# EAGLE design Main (EAGLE 7.2.0)
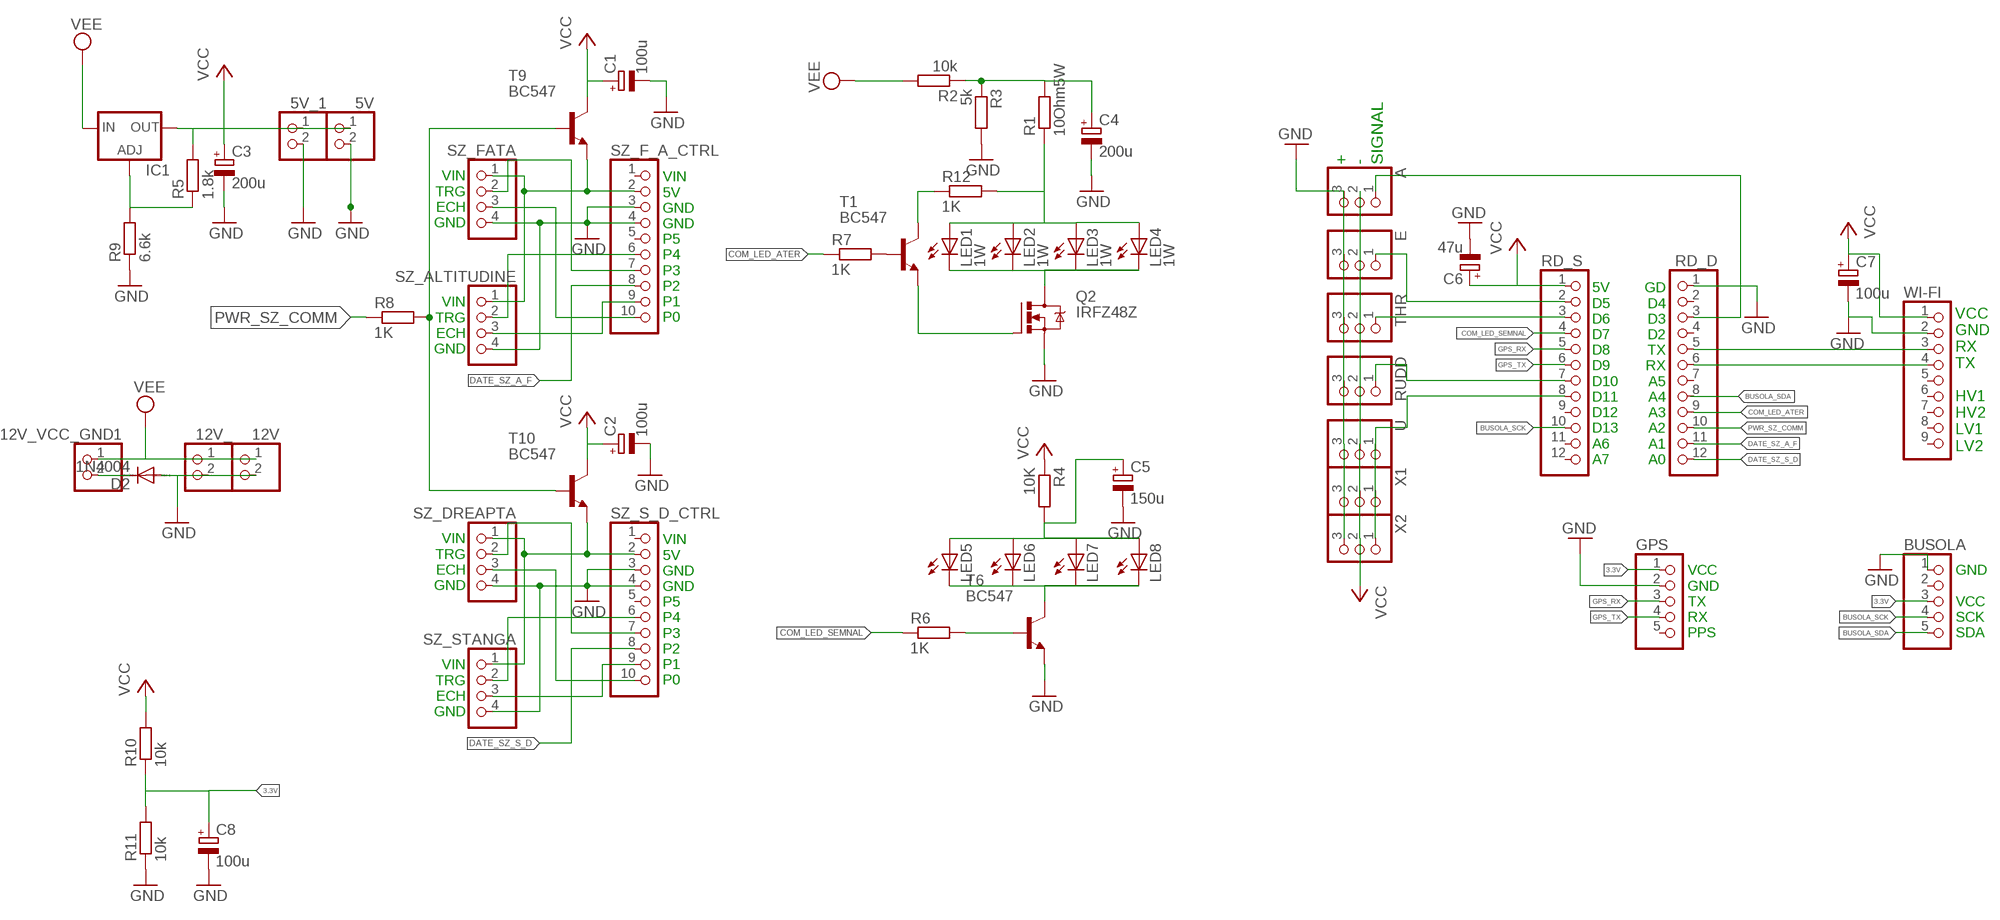
[diagram p0: schematic, sheet 1]

## Parts
5V  PINHD-1X2  [1X02]
5V_1  PINHD-1X2  [1X02]
12V  PINHD-1X2  [1X02]
12V_  PINHD-1X2  [1X02]
12V_VCC_GND1  PINHD-1X2  [1X02]
A  PINHD-1X3/90  [1X03/90]
BUSOLA  PINHD-1X5  [1X05]
C1  100u  CPOL-EUE2-5  [E2-5]
C2  100u  CPOL-EUE2-5  [E2-5]
C3  200u  CPOL-EUE2-5  [E2-5]
C4  200u  CPOL-EUE2-5  [E2-5]
C5  150u  CPOL-EUE2-5  [E2-5]
C6  47u  CPOL-EUE2-5  [E2-5]
C7  100u  CPOL-EUE2-5  [E2-5]
C8  100u  CPOL-EUE2-5  [E2-5]
D2  1N4004  [DO41-10]
E  PINHD-1X3/90  [1X03/90]
GPS  PINHD-1X5  [1X05]
IC1  LM317TL  [317TL]
LED1  1W  LEDSIDELED  [OSRAM-SIDELED]
LED2  1W  LEDSIDELED  [OSRAM-SIDELED]
LED3  1W  LEDSIDELED  [OSRAM-SIDELED]
LED4  1W  LEDSIDELED  [OSRAM-SIDELED]
LED5  LED5MM  [LED5MM]
LED6  LED5MM  [LED5MM]
LED7  LED5MM  [LED5MM]
LED8  LED5MM  [LED5MM]
Q2  IRFZ48Z  [TO220BH]
R1  10Ohm5W  R-EU_0309/12  [0309/12]
R2  10k  R-EU_0309/12  [0309/12]
R3  5k  R-EU_0309/12  [0309/12]
R4  10K  R-EU_0309/12  [0309/12]
R5  1.8k  R-EU_0309/12  [0309/12]
R6  1K  R-EU_0309/12  [0309/12]
R7  1K  R-EU_0309/12  [0309/12]
R8  1K  R-EU_0309/12  [0309/12]
R9  6.6k  R-EU_0309/12  [0309/12]
R10  10k  R-EU_0309/12  [0309/12]
R11  10k  R-EU_0309/12  [0309/12]
R12  1K  R-EU_0309/12  [0309/12]
RD_D  PINHD-1X12  [1X12]
RD_S  PINHD-1X12  [1X12]
RUDD  PINHD-1X3/90  [1X03/90]
SZ_ALTITUDINE  PINHD-1X4  [1X04]
SZ_DREAPTA  PINHD-1X4  [1X04]
SZ_F_A_CTRL  PINHD-1X10  [1X10]
SZ_FATA  PINHD-1X4  [1X04]
SZ_S_D_CTRL  PINHD-1X10  [1X10]
SZ_STANGA  PINHD-1X4  [1X04]
T1  BC547  [TO92]
T6  BC547  [TO92]
T9  BC547  [TO92]
T10  BC547  [TO92]
THR  PINHD-1X3/90  [1X03/90]
U  PINHD-1X3/90  [1X03/90]
WI-FI  PINHD-1X9  [1X09]
X1  PINHD-1X3/90  [1X03/90]
X2  PINHD-1X3/90  [1X03/90]

## Nets
3.3V: BUSOLA.3 C8.+ GPS.1 R10.1 R11.2
BUSOLA_SCK: BUSOLA.4 RD_S.10
BUSOLA_SDA: BUSOLA.5 RD_D.8
COM_ALIM_SZ_S_D: R8.2 T9.2(B) T10.2(B)
COM_LED_ATER: R7.1 RD_D.9
COM_LED_SEMNAL: R6.1 RD_S.4
DATE_SZ_A_F: RD_D.11 SZ_F_A_CTRL.8
DATE_SZ_S_D: RD_D.12 SZ_S_D_CTRL.8
GND: 5V.2 5V_1.2 12V.2 12V_.2 A.3 BUSOLA.1 C1.- C2.- C3.- C4.- C5.- C6.- C7.- C8.- D2.A E.3 GPS.2 Q2.S R3.2 R9.1 R11.1 RD_D.1 RUDD.3 SZ_ALTITUDINE.4 SZ_DREAPTA.4 SZ_F_A_CTRL.3 SZ_F_A_CTRL.4 SZ_FATA.4 SZ_S_D_CTRL.3 SZ_S_D_CTRL.4 SZ_STANGA.4 T6.1(E) THR.3 U.3 WI-FI.2 X1.3 X2.3
GPS_RX: GPS.3 RD_S.5
GPS_TX: GPS.4 RD_S.6
N$1: SZ_F_A_CTRL.7 SZ_FATA.2
N$2: 12V_VCC_GND1.2 D2.C
N$3: IC1.1(ADJ) R5.1 R9.2
N$5: SZ_F_A_CTRL.10 SZ_FATA.3
N$6: SZ_ALTITUDINE.2 SZ_F_A_CTRL.6
N$7: SZ_ALTITUDINE.3 SZ_F_A_CTRL.9
N$8: SZ_DREAPTA.2 SZ_S_D_CTRL.7
N$9: SZ_DREAPTA.3 SZ_S_D_CTRL.10
N$10: SZ_S_D_CTRL.6 SZ_STANGA.2
N$11: SZ_S_D_CTRL.9 SZ_STANGA.3
N$12: SZ_ALTITUDINE.1 SZ_F_A_CTRL.2 SZ_FATA.1 T9.1(E)
N$13: SZ_DREAPTA.1 SZ_S_D_CTRL.2 SZ_STANGA.1 T10.1(E)
N$14: LED1.C LED2.C LED3.C LED4.C Q2.D
N$15: LED1.A LED2.A LED3.A LED4.A R1.1 R12.2
N$16: Q2.G T1.1(E)
N$17: C4.+ R1.2 R2.1 R3.1
N$19: LED5.K(C) LED6.K(C) LED7.K(C) LED8.K(C) T6.3(C)
N$20: C5.+ LED5.A LED6.A LED7.A LED8.A R4.2
N$21: A.1 RD_D.3
N$22: R6.2 T6.2(B)
N$23: R7.2 T1.2(B)
N$24: E.1 RD_S.2
N$25: RD_S.3 THR.1
N$26: RD_S.7 RUDD.1
N$27: R12.1 T1.3(C)
N$35: RD_S.8 U.1 X1.1 X2.1
N$37: RD_D.5 WI-FI.3
N$38: RD_D.6 WI-FI.4
PWR_SZ_COMM: R8.1 RD_D.10
VCC: 5V.1 5V_1.1 A.2 C1.+ C2.+ C3.+ C6.+ C7.+ E.2 IC1.2(OUT) R4.1 R5.2 R10.2 RD_S.1 RUDD.2 T9.3(C) T10.3(C) THR.2 U.2 WI-FI.1 X1.2 X2.2
VEE: 12V.1 12V_.1 12V_VCC_GND1.1 IC1.3(IN) R2.2
Unconnected: BUSOLA.2 GPS.5 RD_D.2 RD_D.4 RD_D.7 RD_S.9 RD_S.11 RD_S.12 SZ_F_A_CTRL.1 SZ_F_A_CTRL.5 SZ_S_D_CTRL.1 SZ_S_D_CTRL.5 WI-FI.5 WI-FI.6 WI-FI.7 WI-FI.8 WI-FI.9

## Notes on the sheet
- +
  -
  SIGNAL
- VIN
  TRG
  ECH
  GND
- VIN
  5V
  GND
  GND
  P5
  P4
  P3
  P2
  P1
  P0
- VIN
  TRG
  ECH
  GND
- 5V
  D5
  D6
  D7
  D8
  D9
  D10
  D11
  D12
  D13
  A6
  A7
- GD
  D4
  D3
  D2
  TX
  RX
  A5
  A4
  A3
  A2
  A1
  A0
- VCC
  GND
  RX
  TX
  
  HV1
  HV2
  LV1
  LV2
- VIN
  TRG
  ECH
  GND
- VCC
  GND
  TX
  RX
  PPS
- GND
  
  VCC
  SCK
  SDA
- VIN
  5V
  GND
  GND
  P5
  P4
  P3
  P2
  P1
  P0
- VIN
  TRG
  ECH
  GND

## Library data of the parts
5V 5V_1 12V 12V_ 12V_VCC_GND1 = pinhead:PINHD-1X2: PIN HEADER
A E RUDD THR U X1 X2 = pinhead:PINHD-1X3: PIN HEADER
BUSOLA GPS = pinhead:PINHD-1X5: PIN HEADER
C1-C8 = resistor:CPOL-EU: POLARIZED CAPACITOR, European symbol
D2 = diode:1N4004: DIODE general purpose rectifier, 1 A
IC1 = v-reg:LM317TL: VOLTAGE REGULATOR
LED1-LED8 = led:LED: LED OSRAM: - CHIPLED LG R971, LG N971, LY N971, LG Q971, LY Q971, LO R971, LY R971 LH N974, LH R974 LS Q976, LO Q976, LY Q976 LO Q996 - Hyper CHIPLED LW Q18S LB Q993, LB Q99A, LB R99A - SideLED LS A670, LO A670, LY A670, LG A670, LP A670 LB A673, LV A673, LT A673, LW A673 LH A674 LY A675 LS A676, LA A676, LO A676, LY A676, LW A676 LS A679, LY A679, LG A679 - Hyper Micro SIDELED® LS Y876, LA Y876, LO Y876, LY Y876 LT Y87S - SmartLED LW L88C, LW L88S LB L89C, LB L89S, LG L890 LS L89K, LO L89K, LY L89K LS L896, LA L896, LO L896, LY L896 - TOPLED LS T670, LO T670, LY T670, LG T670, LP T670 LSG T670, LSP T670, LSY T670, LOP T670, LYG T670 LG T671, LOG T671, LSG T671 LB T673, LV T673, LT T673, LW T673 LH T674 LS T676, LA T676, LO T676, LY T676, LB T676, LH T676, LSB T676, LW T676 LB T67C, LV T67C, LT T67C, LS T67K, LO T67K, LY T67K, LW E67C LS E67B, LA E67B, LO E67B, LY E67B, LB E67C, LV E67C, LT E67C LW T67C LS T679, LY T679, LG T679 LS T770, LO T770, LY T770, LG T770, LP T770 LB T773, LV T773, LT T773, LW T773 LH T774 LS E675, LA E675, LY E675, LS T675 LS T776, LA T776, LO T776, LY T776, LB T776 LHGB T686 LT T68C, LB T68C - Hyper Mini TOPLED® LB M676 - Mini TOPLED Santana® LG M470 LS M47K, LO M47K, LY M47K Source: http://www.osram.convergy.de LUXEON: - LUMILED® LXK2-PW12-R00, LXK2-PW12-S00, LXK2-PW14-U00, LXK2-PW14-V00 LXK2-PM12-R00, LXK2-PM12-S00, LXK2-PM14-U00 LXK2-PE12-Q00, LXK2-PE12-R00, LXK2-PE12-S00, LXK2-PE14-T00, LXK2-PE14-U00 LXK2-PB12-K00, LXK2-PB12-L00, LXK2-PB12-M00, LXK2-PB14-N00, LXK2-PB14-P00, LXK2-PB14-Q00 LXK2-PR12-L00, LXK2-PR12-M00, LXK2-PR14-Q00, LXK2-PR14-R00 LXK2-PD12-Q00, LXK2-PD12-R00, LXK2-PD12-S00 LXK2-PH12-R00, LXK2-PH12-S00 LXK2-PL12-P00, LXK2-PL12-Q00, LXK2-PL12-R00 Source: www.luxeon.com KINGBRIGHT: KA-3528ASYC Source: www.kingbright.com
Q2 = transistor-power:IRFZ48: N Channel HEXFET® Power MOSFET Logic Level Source: http://www.irf.com/product-info/datasheets/data/irfz48z.pdf
R1-R12 = rcl:R-EU_: RESISTOR, European symbol
RD_D RD_S = pinhead:PINHD-1X12: PIN HEADER
SZ_ALTITUDINE SZ_DREAPTA SZ_FATA SZ_STANGA = pinhead:PINHD-1X4: PIN HEADER
SZ_F_A_CTRL SZ_S_D_CTRL = pinhead:PINHD-1X10: PIN HEADER
T1 T6 T9 T10 = transistor:BC547: NPN TRANSISTOR
WI-FI = pinhead:PINHD-1X9: PIN HEADER

## Board
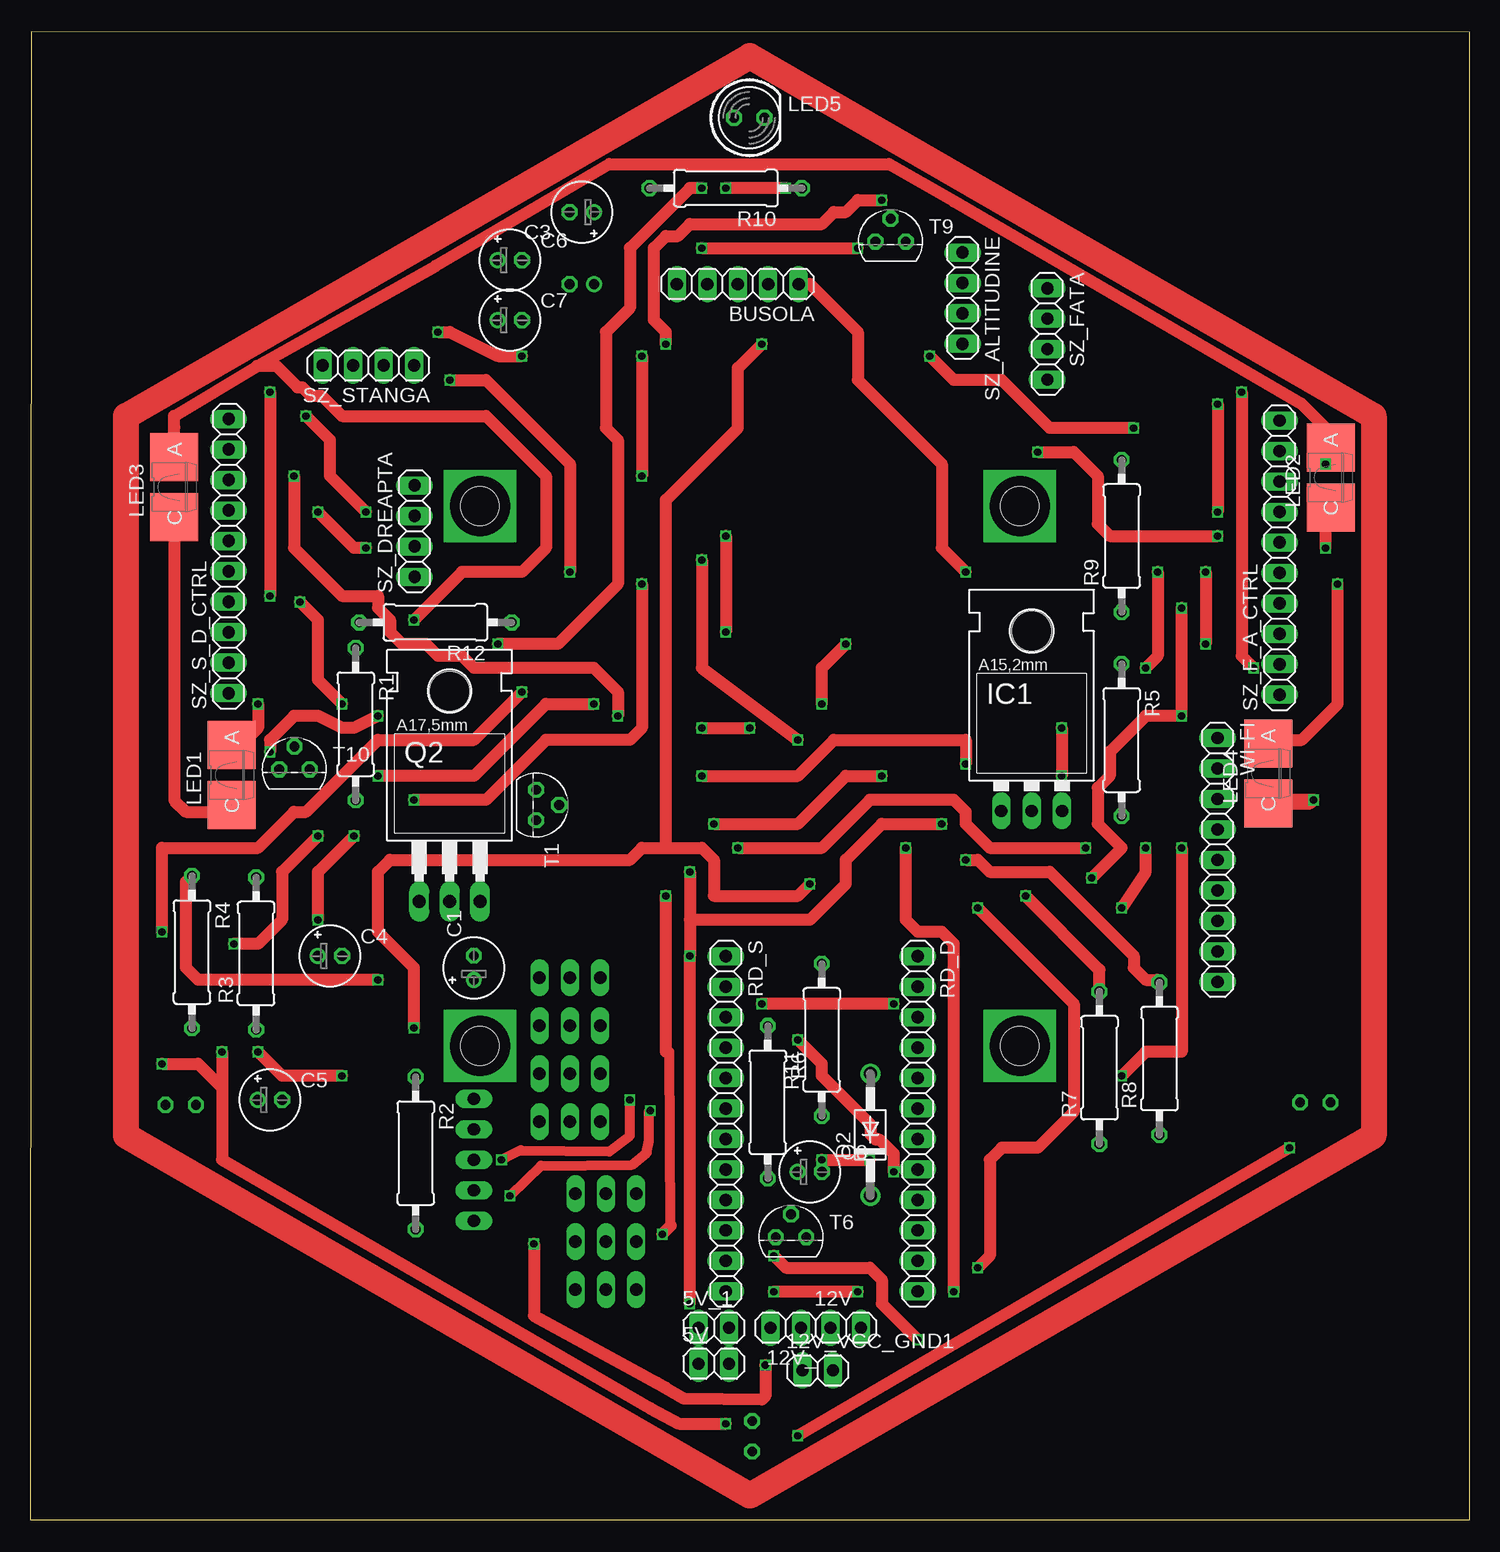
[diagram p1: board, top side]
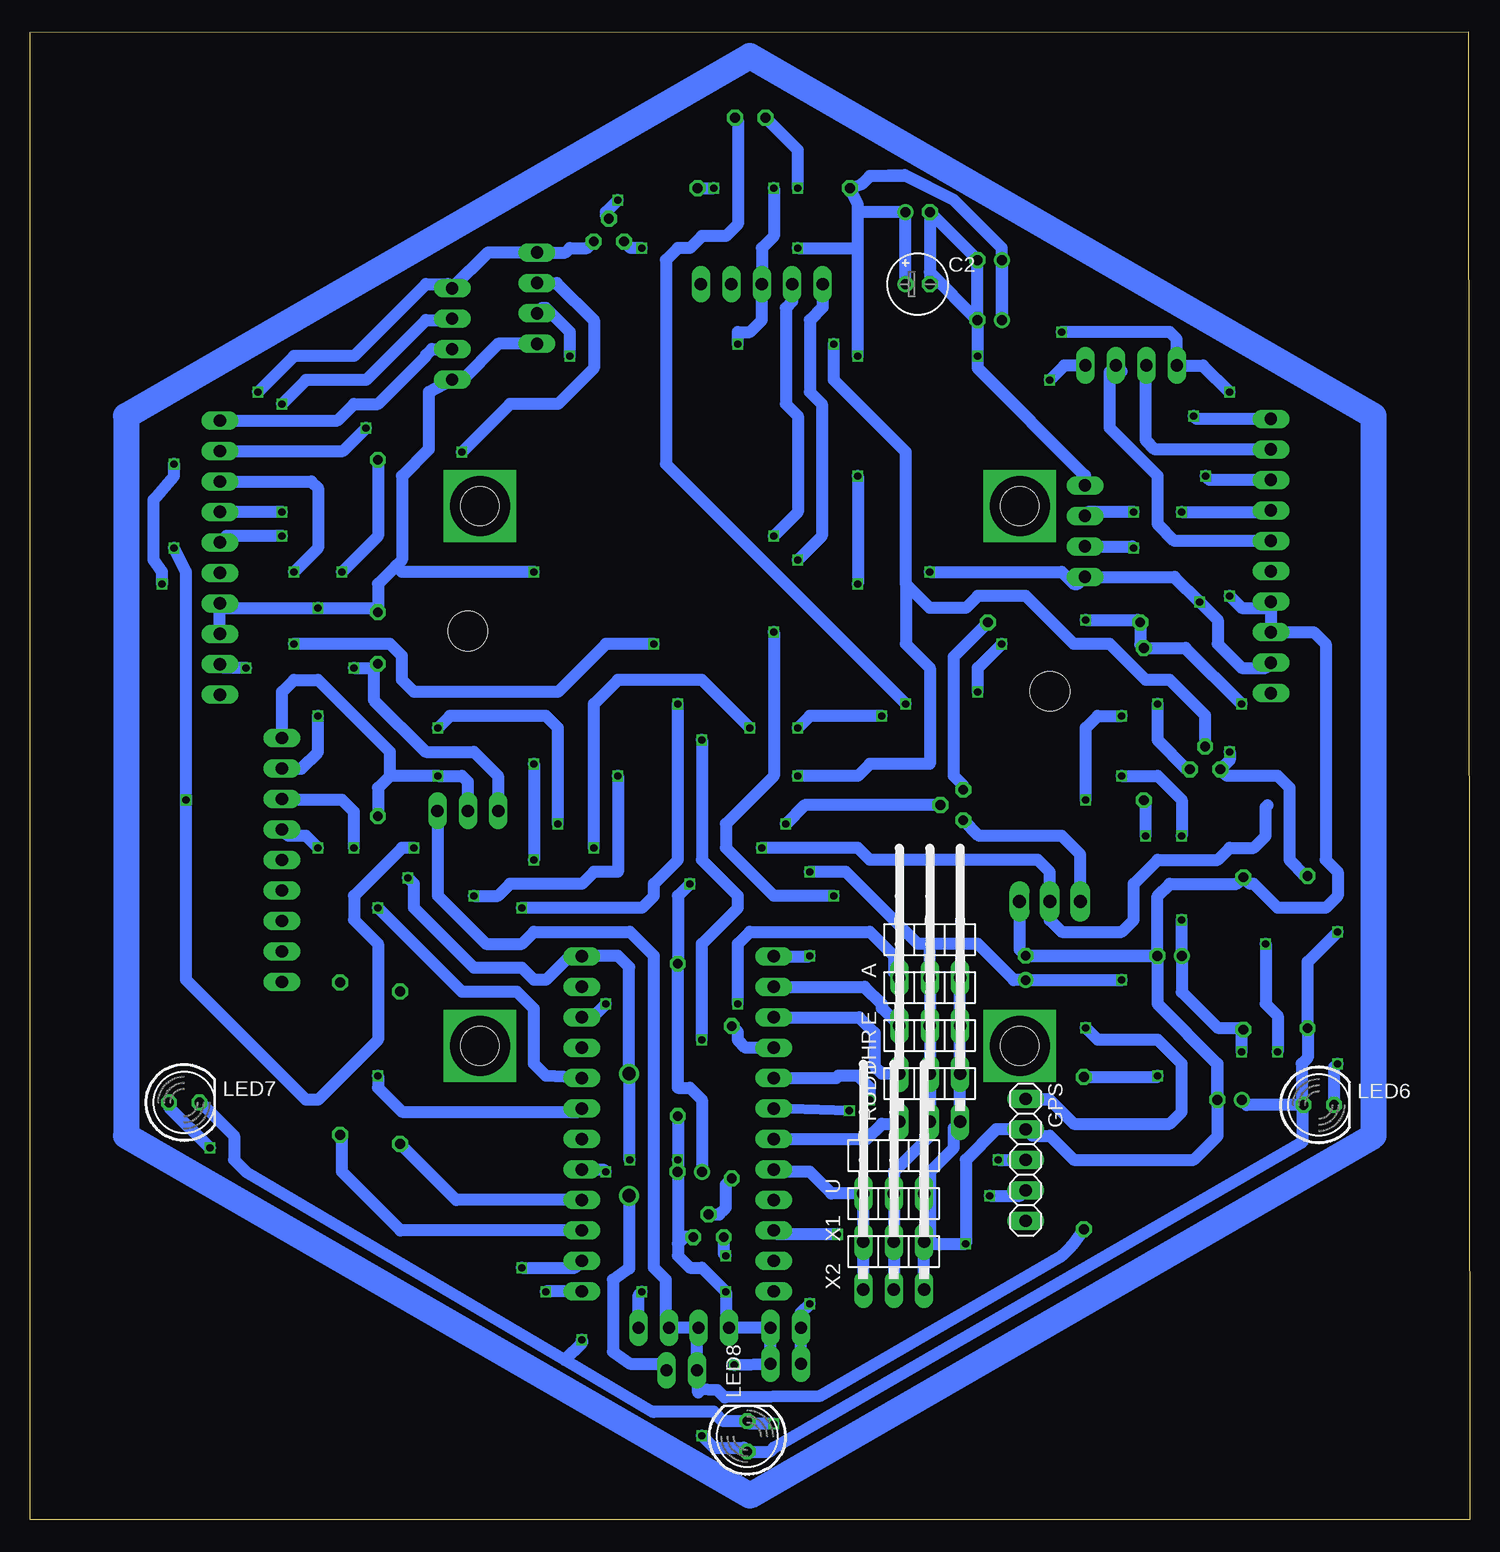
[diagram p2: board, bottom side, seen from below]

Size 120 x 124.03 mm. Coordinates in mm from the lower left corner, seen from the top.
Outline: 0,0 120,0 120,124 0.1,124.03 0,0
Copper layers (1*16): Top 0.035mm / dielectric 1.5mm / Bottom 0.035mm
Design rules "default *": minimum track width 10mil, minimum drill 28mil, track to track 8mil, track to pad 8mil, pad to pad 8mil, via to via 8mil, smd to smd 8mil, copper to edge 40mil, drill to drill 8mil, minimum pad ring 10mil, minimum via ring 0.08mm, stop-mask expansion 4mil, vias tented up to drill 0mil, thermal gap 10mil
Holes 3.2 mm at 82.5,84.5 37.5,84.5 37.5,39.5 82.5,39.5

### Footprints (pad centres in the part's own frame; a part is rotated, then mirrored left to right if it is on the bottom)
1X02 = drill 1.016 long: 1 -1.27,0; 2 1.27,0
1X03/90 = drill 1.016 long: 1 -2.54,-3.81; 2 0,-3.81; 3 2.54,-3.81
1X05 = drill 1.016 long: 1 -5.08,0; 2 -2.54,0; 3 0,0; 4 2.54,0; 5 5.08,0
E2-5 = drill 0.813 pad 1.27: + -1.016,0 | drill 0.813 pad 1.27 octagon: - 1.016,0
DO41-10 = drill 1.118: A 5.08,0; C -5.08,0
317TL = drill 1.016 long: 1 -2.54,-3.81; 2 0,-3.81; 3 2.54,-3.81 | hole 3.302: 0,11.176
OSRAM-SIDELED = smd 4 x 4: A 0,2.5; C 0,-2.5
LED5MM = drill 0.813 octagon: A -1.27,0; K 1.27,0
TO220BH = drill 1.118 long: D 0,-6.35; G -2.54,-6.35; S 2.54,-6.35 | hole 3.302: 0,11.176
0309/12 = drill 0.813 octagon: 1 -6.35,0; 2 6.35,0
1X12 = drill 1.016 long: 1 -13.97,0; 2 -11.43,0; 3 -8.89,0; 4 -6.35,0; 5 -3.81,0; 6 -1.27,0; 7 1.27,0; 8 3.81,0; 9 6.35,0; 10 8.89,0; 11 11.43,0; 12 13.97,0
1X04 = drill 1.016 long: 1 -3.81,0; 2 -1.27,0; 3 1.27,0; 4 3.81,0
1X10 = drill 1.016 long: 1 -11.43,0; 2 -8.89,0; 3 -6.35,0; 4 -3.81,0; 5 -1.27,0; 6 1.27,0; 7 3.81,0; 8 6.35,0; 9 8.89,0; 10 11.43,0
TO92 = drill 0.813 octagon: 1 1.27,0; 2 0,1.905; 3 -1.27,0
1X09 = drill 1.016 long: 1 -10.16,0; 2 -7.62,0; 3 -5.08,0; 4 -2.54,0; 5 0,0; 6 2.54,0; 7 5.08,0; 8 7.62,0; 9 10.16,0

### Placement (x,y rotation side)
5V  57,13 0 top
5V_1  57,16 0 top
12V  68,16 0 top
12V_  63,16 180 top
12V_VCC_GND1  65.66,12.45 0 top
A  45,49 0 bottom
BUSOLA  59,103 180 top
C1  37,46 90 top
C2  46,103 0 bottom
C3  46,109 180 top
C4  25,47 0 top
C5  20,35 0 top
C6  40,105 0 top
C7  40,100 0 top
C8  65,29 0 top
D2  70.06,32.09 90 top
E  45,45 0 bottom
GPS  37,30 270 bottom
IC1  83.5,62.9 0 top
LED1  16.82,62.08 0 top
LED2  108.43,86.88 0 top
LED3  12.04,86.08 0 top
LED4  103.22,62.21 0 top
LED5  59.96,116.87 0 top
LED6  12.56,34.58 0 bottom
LED7  107.15,34.78 0 bottom
LED8  60.2,6.95 90 bottom
Q2  34.98,57.89 0 top
R1  27.15,66.32 270 top
R2  32.15,30.56 270 top
R3  18.85,47.2 90 top
R4  13.5,47.32 270 top
R5  91,65 270 top
R6  61.5,34.8 270 top
R7  89.15,37.68 90 top
R8  94.15,38.44 90 top
R9  91,82 90 top
R10  58,111 180 top
R11  66,40 90 top
R12  33.8,74.8 180 top
RD_D  74,33 270 top
RD_S  58,33 270 top
RUDD  45,37 0 bottom
SZ_ALTITUDINE  77.74,101.83 270 top
SZ_DREAPTA  32.05,82.41 90 top
SZ_F_A_CTRL  104.17,80.2 90 top
SZ_FATA  84.8,98.84 270 top
SZ_S_D_CTRL  16.55,80.33 90 top
SZ_STANGA  28.21,96.22 180 top
T1  42.2,59.58 270 top
T6  63.44,23.55 0 top
T9  71.74,106.55 0 top
T10  22.04,62.55 0 top
THR  45,41 0 bottom
U  48,31 0 bottom
WI-FI  99,55 270 top
X1  48,27 0 bottom
X2  48,23 0 bottom

### Tracks (layer width: path | path; a pad name or v marks a point on that pad's centre or on a via)
3.3V  (via drill 0.6)
  Top 1.016: v32,41 32,46 29,49 29,54 30,55 50,55 51,56 53,56 | 53,56 56,56 57,55 57,52 64,52 v65,53 | v63,111 v58,111 | 53,56 53,85 59,91 59,96 v61,98
  Bottom 1.016: C8.+ 64,29.02 64,35 65,36 66,36 R11.2 66,52 v65,53 | 35,35 35.08,35.08 GPS.1 35,35 | 35,35 33,33 25,33 24,34 24,38 26,40 31,40 v32,41 | R10.1 v63,111 | v58,111 58,107 59,106 BUSOLA.3 59,100 60,99 61,99 v61,98
BUSOLA_SCK  (via drill 0.6)
  Top 0.813: 53.4,24.5 53.3,39 53,39
  Top 1.016: 53.4,24.5 v52.7,23.8 | v58,82 v58,74 | 53,39 v53,52
  Bottom 1.016: v52.7,23.8 57.69,23.8 RD_S.10 | BUSOLA.4 56.46,101.54 57,101 57,93 56,92 56,84 v58,82 | v53,52 58,52 62,56 62,58 58,62 v58,74
BUSOLA_SDA  (via drill 0.6)
  Top 1.016: v72,29 72,30.5 70.8,31.7 70.5,31.7 70.1,32.1 70.1,32.9 66,37 66,38 v64,40 | v56,80 56,71 v64,65
  Bottom 1.016: RD_D.8 72.19,29.19 v72,29 | v64,40 64,48 61,51 61,52 64,55 v64,65 | BUSOLA.5 53.92,101.08 55,100 55,94 54,93 54,82 v56,80
COM_ALIM_SZ_S_D  (via drill 0.6)
  Top 1.016: v53,98 53,99 52,100 52,106 53,107 54,107 55,108 66,108 67,109 68,109 69,110 v71,110 | v56,62 64,62 67,65 78,65 v78,63 | v78,55 79,55 80,54 85,54 92,47 92,46 93,45 93.94,45 R8.2
  Bottom 1.016: T10.2 22.04,67.04 25,70 27,70 30,73 33,73 37,77 41,77 42,76 45,76 47,78 | 47,78 47,89 53,95 v53,98 | T9.2 72,108.72 72,109 v71,110 | 47,78 47,73 45,71 45,63 50,63 51,62 v56,62 | v78,63 v78,55
COM_LED_ATER
  Bottom 1.016: RD_D.9 84.47,26.65 R7.1
COM_LED_SEMNAL
  Bottom 1.016: RD_S.4 60.35,39.35 61,40 61,40.65 R6.1
DATE_SZ_A_F  (via drill 0.6)
  Top 1.016: v98,79 v98,73 | v79,21 80,22 80,30 81,31 84,31 87,34 87,43 v79,51 | v66,68 66,71 v68,73
  Bottom 1.016: SZ_F_A_CTRL.8 96.55,86.55 96,86 96,81 v98,79 | v79,21 74.57,21 RD_D.11 | v79,51 69,51 68,52 68,53 66,55 v66,68 | v68,73 72,73 76,69 88,69 89,70 89,72 90,73 v98,73
DATE_SZ_S_D  (via drill 0.6)
  Top 1.016: v22,87 22,81 26,77 29,77 29,76 30,75 30,74 31,73 33,73 34,72 36,72 37,71 47,71 49,69 v49,67 | v56,66 v60,66 | v77,19 77,48 76,49 74,49 73,50 v73,56
  Bottom 1.016: SZ_S_D_CTRL.8 21.68,86.68 v22,87 | v49,67 55,67 v56,66 | v60,66 64,70 71,70 73,68 v73,56 | RD_D.12 76.97,19.03 v77,19
GND  (via drill 0.6)
  Top 1.016: v69,19 v62,19 | v20,94 v20,77 | v34,99 35,99 39,97 v41,97 | v42,23 42,17 51.04,12.07 | 51.04,12.07 52.23,11.42 | 52.23,11.42 53,11 | v96,76 v96,67 93,67 90,64 90,62 89,61 89,58 91,56 v88.5,53.5 | BUSOLA.1 65,103 69,99 69,95 76,88 76,81 v78,79 | v61.3,12.9 61.3,10.3 61,10 54.5,10.1 52.23,11.42 | v66,30 v70,30 | 51,12.11 51.04,12.07
  Bottom 1.016: 21.02,38.02 C5.- 21,34.98 | 21.02,38.02 26,43 26,46.98 | 26,46.98 C4.- | C4.- 26.02,51.98 25,53 19.4,53 R3.2 18.3,53 18,53 16,51 12,51 11,52 11,54 12,55 12,73 12.98,73.98 SZ_S_D_CTRL.3 16.55,76 | Q2.S 37.52,47.52 37,47 C4.- | 12V.2 69.27,18.73 v69,19 | R11.1 v66,30 66,29 | 66,29 66,23 | 66,23 66,22 65,21 64,21 v62,19 62,16.27 12V_.2 5V_1.2 5V.2 v61.3,12.9 | 66,23 65.45,23.55 65.45,23.6 64.8,23.6 64.8,23.5 64.7,23.5 T6.1 | SZ_S_D_CTRL.4 16.55,76 | C8.- 65.98,28.98 66,29 | v70,30 70.06,30.06 D2.A 70.06,46.06 71,47 73.97,47 RD_D.1 74.03,47 75,47 77,45 78,45 79,46 83,46 88,51 88,53 v88.5,53.5 | 21,34.98 21,32 23,30 33,30 35,32 36,32 | 36,32 36.46,32 | v20,94 22.22,96.22 SZ_STANGA.4 24.4,98.4 25,99 v34,99 | v20,77 19,76 16.55,76 | C7.- C6.- 41.02,105.03 C3.- C2.- | C7.- 41.02,100.02 45,104 45,103 | C7.- 41,99.98 v41,97 41,96 32.05,87.05 SZ_DREAPTA.4 | 36,32 36.54,32.54 GPS.2 39.46,32.54 42,30 v42,23 45,23 | 21,34.98 21,38 21.02,38.02 | 26,46.98 26,47 36.98,47 C1.- | SZ_ALTITUDINE.4 80.98,98.02 84,95 84.83,95 | 89.5,79.5 89,80 89,87 86.77,89.23 86.77,94 SZ_FATA.4 84.83,95 | 89.5,79.5 91,78 R9.1 91.35,76 v96,76 104,76 104.17,75.83 SZ_F_A_CTRL.3 SZ_F_A_CTRL.4 | v78,79 89,79 89.5,79.5 | 45.19,23.19 X1.3 X2.3 | 45.19,23.19 45,23 | 45.19,23.19 45.19,26.92 U.3 | A.3 E.3 THR.3 RUDD.3 43,32.65 43,31 45,29 45,23 | WI-FI.2 97.38,62.62 96,64 v96,67 | 85,95 84.83,95
GPS_RX  (via drill 0.6)
  Top 0.813: v39.3,30 40.9,30.8 48.3,30.7 50,32 v50,35
  Bottom 1.016: RD_S.5 52.81,36.81 52.62,37 51,37 50,36 v50,35 | v39.3,30 GPS.3
GPS_TX  (via drill 0.6)
  Top 0.813: v40,27 42.6,29.5 50.2,29.6 51.4,30.6 51.6,31.6 51.6,34 v51.7,34.1
  Bottom 0.813: v51.7,34.1 RD_S.6
  Bottom 1.016: v40,27 37.46,27 GPS.4
N$1  (via drill 0.6)
  Top 1.016: v99,93 v99,84
  Bottom 1.016: v99,93 97,95 92,95 87,100 84.91,100 SZ_FATA.2 | v99,84 SZ_F_A_CTRL.7
N$2
  Bottom 1.016: D2.C 70.06,20.94 71.4,20 71.4,14 70,13 67.48,13 12V_VCC_GND1.2
N$3  (via drill 0.6)
  Top 1.016: v94,79 94,72 v93,71
  Bottom 1.016: R9.2 91,82 v94,79 | v93,71 91.35,71 | 91.35,71 R5.1 | 91.35,71 91.35,68.35 87,64 83,64 81,62 81,59.13 IC1.1
N$4  (via drill 5)
  other vias: 82.5,39.5
N$5
  Bottom 1.016: SZ_F_A_CTRL.10 94.37,91.63 93,93 91,93 87,97 87,97.1 86.5,97.6 84.83,97.6 SZ_FATA.3
N$6  (via drill 0.6)
  Top 1.016: v99,82 90,82 89,83 89,87 87,89 v84,89
  Bottom 1.016: SZ_ALTITUDINE.2 76.1,103.1 73,100 73,96 76,93 80,93 v84,89 | v99,82 103.64,82 SZ_F_A_CTRL.6
N$7  (via drill 0.6)
  Top 1.016: v92,91 85,91 81,95 77,95 v75,97
  Bottom 1.016: SZ_F_A_CTRL.9 93.91,89.09 v92,91 | v75,97 75,99 77,101 77.3,101 SZ_ALTITUDINE.3
N$8  (via drill 0.6)
  Top 1.016: v28,81 27,81 v24,84
  Bottom 1.016: SZ_DREAPTA.2 28.14,81.14 v28,81 | v24,84 16.69,84 SZ_S_D_CTRL.7
N$9  (via drill 0.6)
  Top 1.016: v28,84 25,87 25,90 v23,92
  Bottom 1.016: SZ_S_D_CTRL.10 22.76,91.76 v23,92 | v28,84 31.73,84 SZ_DREAPTA.3
N$10
  Bottom 1.016: 29,95.74 SZ_STANGA.2 30,95.7 30,91 26,87 26,83 24.6,81.6 SZ_S_D_CTRL.6
N$11
  Bottom 1.016: SZ_S_D_CTRL.9 26.22,89.22 27,90 27,96.16 SZ_STANGA.3
N$12  (via drill 0.6)
  Top 1.016: v101,94 101,72 v102,71
  Bottom 1.016: v101,94 98,97 93,97 87,103 85.15,103 SZ_FATA.1 81.81,105.64 SZ_ALTITUDINE.1 75.36,105.64 75,106 73.56,106 T9.1 | v102,71 103.86,71 SZ_F_A_CTRL.2
N$13  (via drill 0.6)
  Top 1.016: v35,95 38,95 45,88 v45,79 | v26,68 24,70 24,75 v22.5,76.5
  Bottom 1.016: SZ_S_D_CTRL.2 16.99,71 19,71 21,73 21,75 v22.5,76.5 24.6,78.6 SZ_DREAPTA.1 32.65,78 33,78 34,79 v45,79 | SZ_STANGA.1 33.78,96.22 v35,95 | T10.1 23.55,62.55 26,65 v26,68
N$14  (via drill 0.6)  (1 unrouted)
  Top 1.016: LED3.C 12.04,59.96 13,59 16.24,59 LED1.C | 104,60 v107,60 | v107,60 103.51,60 LED4.C 106.71,59.71 v107,60 | v108,81 108,84 LED2.C | v59,56 66,56 70,60 77,60 78,59 78,58 80,56 v88,56
  Bottom 1.016: LED1.C 17,59.4 17,57 18,56 20,56 21,55 26,55 28,53 28,50 29,49 34,49 34.98,49.98 Q2.D 34.98,53.98 36,55 50,55 51,56 v59,56 | v88,56 89,56 93,52 93,50 91,48 91,40 96,35 97,35 107,45 v107,60 107,79 v108,81
N$15  (via drill 0.6)
  Top 1.016: LED3.A 12.04,91.04 12,92 19,96.2 | 18.9,96.2 19,96.2 | 19,96.2 20.5,96.2 22.3,94.4 22.7,94.4 23.4,93.7 24.3,93.7 26,92 38,92 43,87 43,81 41,79 36,79 v32,75 | v19,68 19,66 18,65 17.24,65 LED1.A | LED2.A 107.93,89.93 108,90 | 108,90 108,91 106,93 77,109.9 71.6,113 48.3,113 33.8,104.5 19,96.2 | LED4.A 103,65 106,65 109,68 v109,78 | v108,88 108,90
  Bottom 1.016: v32,75 27.65,75 R12.2 27.45,72.97 R1.1 23.67,72.67 v19,68 | v109,78 109,79 109.7,80 109.7,85 108,87 v108,88
N$16
  Bottom 1.016: Q2.G 32.44,55.44 34,57 40.89,57 T1.1
N$17  (via drill 0.6)
  Top 1.016: v24,50 24,54 v27,57 | v26,37 21,37 v19,39
  Bottom 1.016: v24,50 23.98,49.98 C4.+ 23.98,43.98 21,41 19,41 R3.1 19,40.7 v19,39 | v27,57 27,59.82 R1.2 | R2.1 26.09,36.91 v26,37
N$19  (via drill 0.6)
  Top 1.016: v11,38 14,38 16,36 | 16,36 16,30 51.7,9.3 54.1,8 v58,8 | v62,22 63,21 70,21 71,20 71,18 v74,15 | v29,62 37,62 43,68 v47,68 | v24,57 21,54 21,50 19,48 v17,48 | v16,39 16,36
  Bottom 1.016: LED6.K 11.29,37.71 v11,38 | LED7.K 105.78,34.78 103,32 103,30 102,29 75.4,13.32 | 75.4,13.32 68.02,8.97 67.99,9 63,9 62.22,8.22 LED8.K 59.98,8 v58,8 | T6.3 62.17,22.17 v62,22 | v74,15 74,14.72 75.4,13.32 | v47,68 67,88 67,105 66,106 65,106 64,107 62,107 61,108 61,116.64 LED5.K | v29,62 26,62 24,60 v24,57 | v17,48 17,43 16,42 v16,39
N$20  (via drill 0.6)
  Top 1.016: v105,31 v64,7 | v11,49 11,56 19,56 22,59 23,59 29,65 37,65 v41,69 | v56,111 55,111 50,106 50,101 48,99 48,91 49,90 49,78 44,73 v39,73
  Bottom 1.016: LED7.A 108.42,34.42 v105,31 | LED6.A 13.9,34.51 13.9,31.5 58,6 58.32,5.68 LED8.A 60.52,6 63,6 v64,7 | LED6.A 18.56,34.58 C5.+ | LED6.A 14,34.75 14,38 13.5,38.5 R4.2 13.5,46.5 v11,49 | v56,111 56,114.18 LED5.A | v41,69 41,71 v39,73
N$21  (via drill 0.6)
  Top 1.016: v72,43 v61,43
  Bottom 1.016: RD_D.3 73.11,41.89 v72,43 | v61,43 61,48 60,49 50,49 48,47 48,45.65 A.1
N$22
  Bottom 1.016: T6.2 62.55,25.45 62,26 62,27.95 R6.2
N$23  (via drill 0.6)
  Top 1.016: v57,58 64,58 68,62 v71,62 | R7.2 89.15,45.85 v83,52
  Bottom 1.016: T1.2 55.42,59.58 v57,58 | v71,62 71,54 73,54 74,53 80,53 81,52 v83,52
N$24
  Bottom 1.016: RD_S.2 50.43,44.43 49,43 49,42.65 E.1
N$25
  Bottom 1.016: RD_S.3 50.89,41.89 49.6,40.6 49.6,37.8 49,37.2 THR.1
N$26
  Bottom 1.016: RD_S.7 50.27,31.73 49,33 47.73,33 RUDD.1
N$27
  Bottom 1.016: R12.1 43,71.95 43,62 42.2,61.2 T1.3
N$30  (via drill 5)
  other vias: 37.5,39.5
N$31
  Top 2.184: 60,122 112,92 112,32 60,2 8,32 8,92 60,122
N$32
  Bottom 2.184: 60,122 112,92 112,32 60,2 8,32 8,92 60,122
N$33  (via drill 5)
  other vias: 82.5,84.5
N$34  (via drill 5)
  other vias: 37.5,84.5
N$35
  Bottom 1.016: X2.1 X1.1 U.1 53.19,27.19 55,29 57.81,29 RD_S.8
N$37  (via drill 0.6)
  Top 1.016: v93,56 93,54 v91,51
  Bottom 1.016: RD_D.5 77,37 78,38 78,42.59 79.41,44 84,44 v91,51 | v93,56 93,59 94,60 98.92,60 WI-FI.3
N$38  (via drill 0.6)
  Top 1.016: v96,56 96,39 93,39 v91,37
  Bottom 1.016: RD_D.6 74.27,34 89,34 91,36 v91,37 | v96,56 97,57 98.46,57 WI-FI.4
PWR_SZ_COMM
  Bottom 1.016: RD_D.10 89.11,24.11 94,29 94,31.94 R8.1
VCC  (via drill 0.6)
  Top 1.016: v55,18 v55,47 55,50 | v55,54 55,50 | v29,45 14,45 13,46 13,53.17 R4.1 | v51,97 v51,87 | v51,78 51,66 50,65 43,65 38,60 v32,60 | v20,64 20,65 22,67 24,67 26,66 27,66 v29,67 | v56,106 v69,106 | 55,50 65,50 68,53 68,55 71,58 v76,58 | v86,66 v86,62
  Bottom 1.016: 5V.1 5V_1.1 55.73,17.27 v55,18 | RD_S.1 55.03,46.97 v55,47 | 45,48 41,48 37.98,44.98 C1.+ 29.02,44.98 v29,45 | 45,48 46,48 52,54 v55,54 | C2.+ C3.+ 51,109 | R4.1 13.67,53.67 15,55 15,61 16,62 20.22,62 T10.3 20,63.32 v20,64 | 39,106 38.98,105.98 C6.+ C7.+ 38.98,104.98 39,105 39,106 | 43,110 47.1,112.1 50,112 | 39,106 43,110 | 43,110 47,112 50,112 | v51,87 v51,78 | IC1.2 83.5,61.5 84,62 v86,62 90,62 | 90,62 91,61 R5.2 | 90,62 90,64 96,70 98,70 99,69 WI-FI.1 | v51,97 51,106 | 51,106 51,109 | 51,109 51,109.65 R10.2 50.65,111.35 50,112 | v56,106 51,106 | v69,106 69.92,106 T9.3 | v86,66 85,67 77,67 76,66 v76,58 | v32,60 32,66 31,67 v29,67 | 45,48 A.2 E.2 THR.2 RUDD.2 45,32 48,29 U.2 X1.2 X2.2
VEE
  Bottom 1.016: 12V_.1 64.39,15.88 12V_VCC_GND1.1 64.31,10.88 | 12V_.1 12V.1 | 12V_.1 67,16 67,20 68,21 68,47 70,49 78,49 79,48 82,48 86,52 86,59.05 IC1.3 | R2.2 33.15,22.85 34,22 54.2,10.3 62.1,10.2 62.7,10.8 64.31,10.88 | 64.3,10.6 64.31,10.88